# Altium schematic sheet ESP01-Schematic.SchDoc
size A
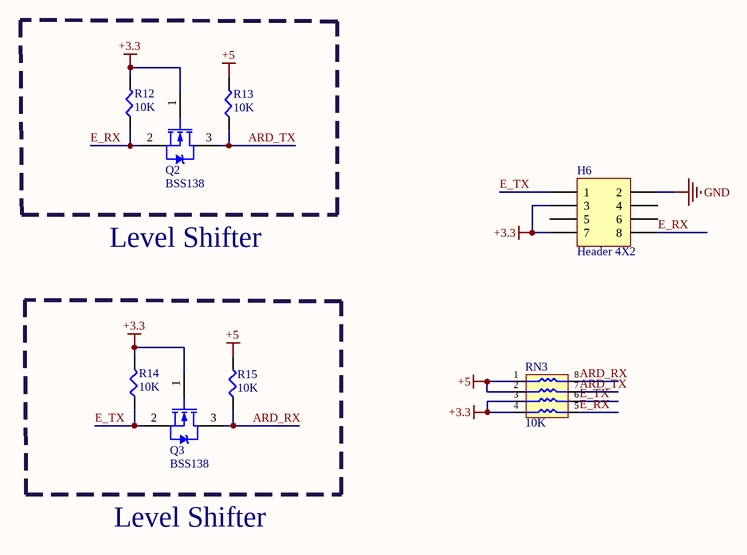
[diagram p0: ESP01-Schematic.SchDoc]

## Parts
H6  Header 4X2  [HDR2X4]
Q2  BSS138  [SMT_TRIODE_NPN]
Q3  BSS138  [SMT_TRIODE_NPN]
R12  10K
R13  10K
R14  10K
R15  10K
RN3  10K  [RA0603-8]

## Nets
+3.3: H6.3 H6.7 Q2.1(G) Q3.1(G) R12.2 R14.2 RN3.3 RN3.4
+5: R13.2 R15.2 RN3.1 RN3.2
GND: H6.2
ARD_RX: Q3.3(D) R15.1 RN3.8
ARD_TX: Q2.3(D) R13.1 RN3.7
E_RX: H6.8 Q2.2(S) R12.1 RN3.5
E_TX: H6.1 Q3.2(S) R14.1 RN3.6

Not connected (* = marked no-connect by the designer): H6 4 5 6

## Notes on the sheet
- Level Shifter

## Library data of the parts
H6 = Header 4X2: Header, 4-Pin, Dual row; LatestRevisionDate: 17-Jul-2002; LatestRevisionNote: Re-released for DXP Platform.; Publisher: Altium Limited
Q2 Q3 = BSS138: N-Channel Power MOSFET; Note: Pin 2 is electrically connected to pin 4.; Published: 8-Jun-2000; LatestRevisionDate: 17-Jul-2002; LatestRevisionNote: Re-released for DXP Platform.; DatasheetVersion: PD-9.814; PackageVersion: Feb-1997; PackageReference: TO-220AB; Publisher: Altium Limited; PackageDescription: TO, Thru-Hole, Vertical, Heatsink Mounted; 3 In-Line Leads; Pitch 2.54 mm; ComponentLink1Description: Manufacturer Link; ComponentLink1URL: http://www.irf.com/
R12-R15 = ERJ-6BQF1R0V: RES SMD 1 OHM 1% 1/3W 0805; Manufacturer: Panasonic Electronic Components; Factory Stock: 0; Unit Price (USD): 0.05834; @ qty: 1500; Minimum Quantity: 1; Value: 1; Power (Watts): 0.333W, 1/3W; Temperature Coefficient: ±200ppm/°C; Part Number: ERJ-6BQF1R0V; Datasheets: https://industrial.panasonic.com/cdbs/www-data/pdf/RDA0000/AOA0000C239.pdf; Image: //media.digikey.com/Renders/Panasonic%20Renders/ERJ-0805%20Pkg.jpg; Digi-Key Part Number: P17499CT-ND; Quantity Available: 808; Packaging: Cut Tape (CT); Series: ERJ; Part Status: Active; Tolerance: ±1%; Composition: Thick Film; Features: Automotive AEC-Q200, Current Sense; Operating Temperature: -55°C ~ 125°C; Package / Case: 0805 (2012 Metric); Supplier Device Package: 0805; Size / Dimension: 0.079" L x 0.049" W (2.00mm x 1.25mm); Height - Seated (Max): 0.028" (0.70mm); Number of Terminations: 2; Failure Rate: -
RN3 = RES_NETWORK: 330 Ohm Â±5% 62.5mW Power Per Element Isolated Resistor Network/Array Â±200ppm/Â°C 1206 _3216 Metric_, Convex, Long Side Terminals; MF: Yageo; MP: YC164-JR-07330RL; Price: None; Availability: Unavailable; SnapEDA_Link: https://www.snapeda.com/parts/YC164-JR-07330RL/Yageo/view-part/106017/?ref=snap; Value: *; Package: 1206 Yageo